# EAGLE design Model55 (EAGLE 6.6.0)
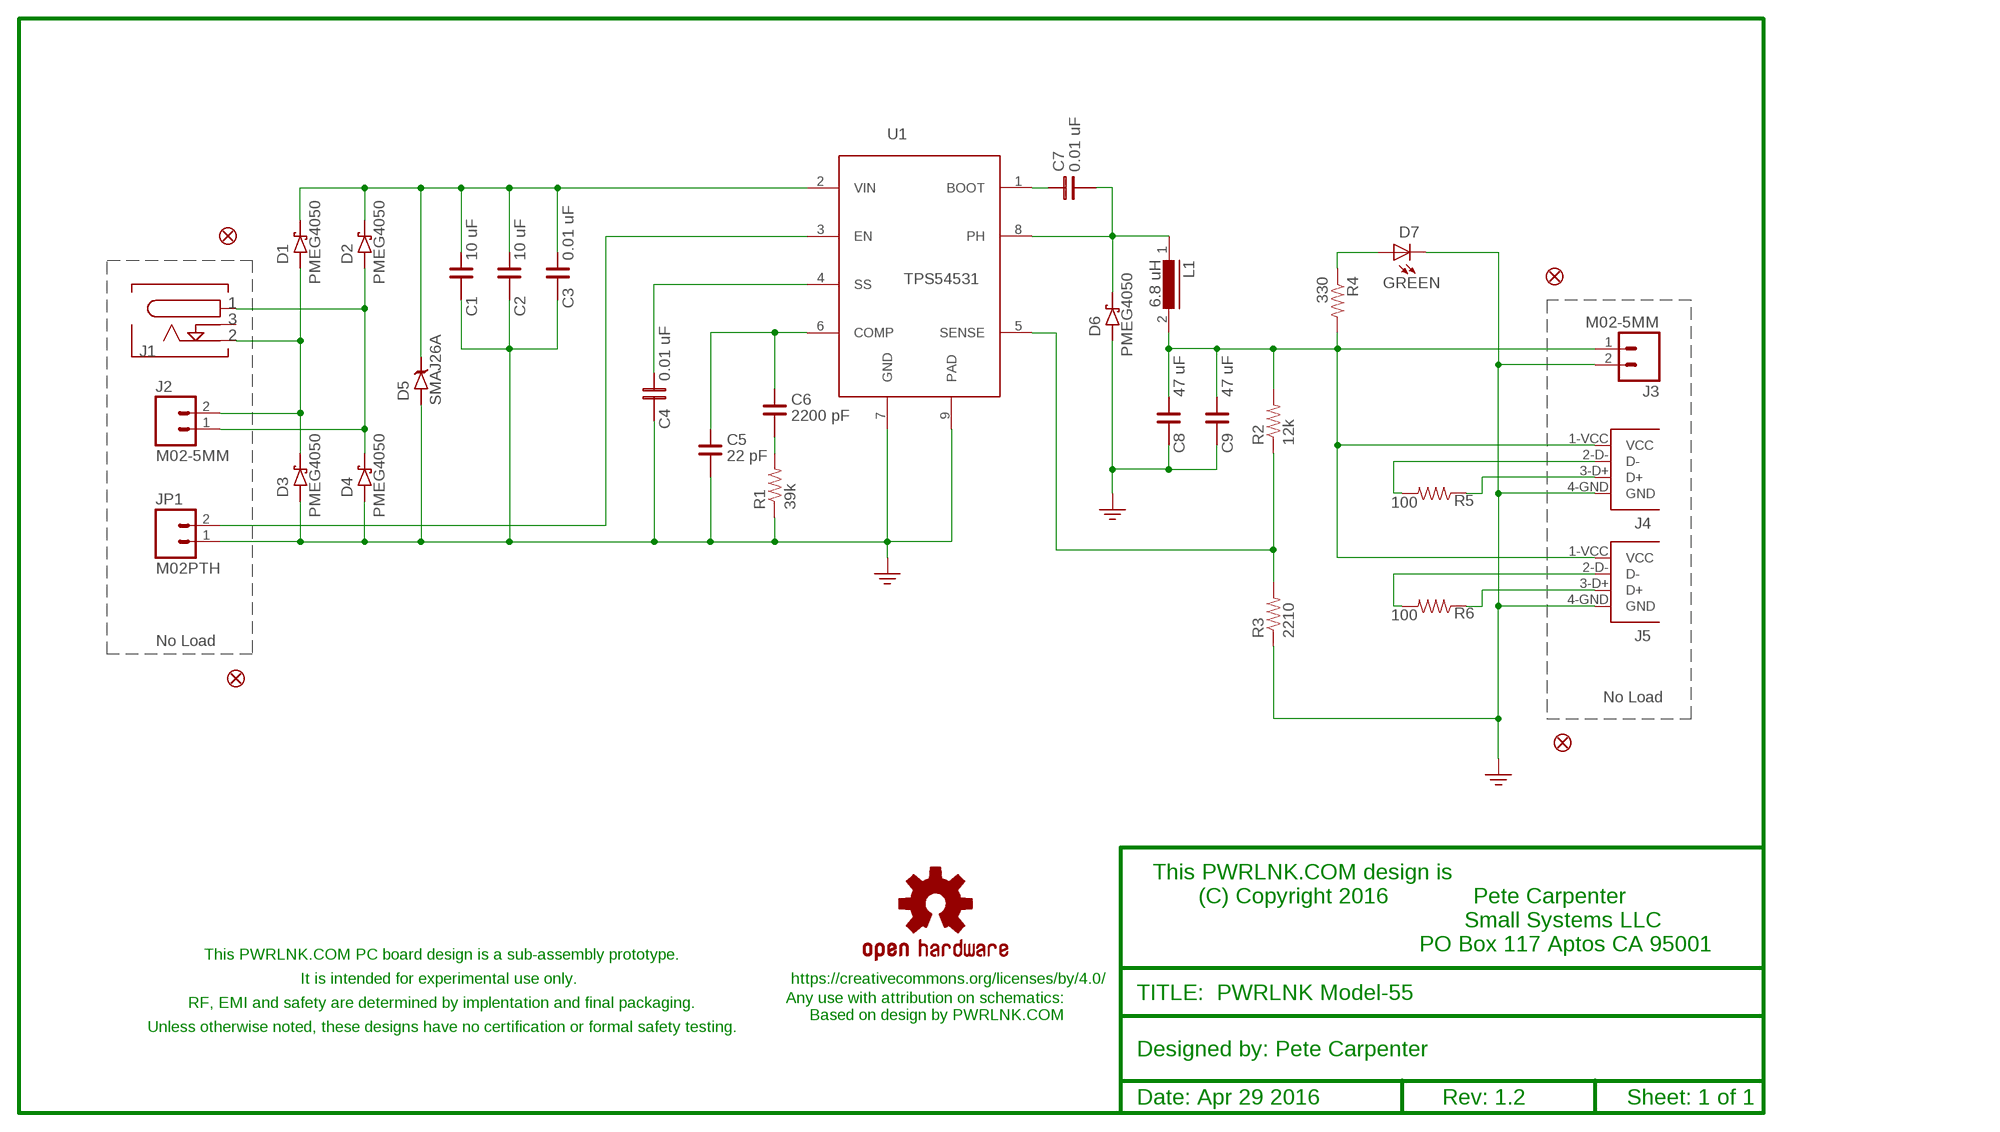
[diagram p0: schematic, sheet 1]

## Parts
C1  10 uF  CN-1210  [1210]
C2  10 uF  CN-1210  [1210]
C3  0.01 uF  CN-0805  [0805]
C4  0.01 uF  CN-0805  [0805]
C5  22 pF  CN-0603  [0603]
C6  2200 pF  CN-0805  [0805]
C7  0.01 uF  CN-0805  [0805]
C8  47 uF  CN-1206  [C1206]
C9  47 uF  CN-1206  [C1206]
D1  PMEG4050EP  [SOD128]
D2  PMEG4050EP  [SOD128]
D3  PMEG4050EP  [SOD128]
D4  PMEG4050EP  [SOD128]
D5  SMAJ26A  [DO214BA]
D6  PMEG4050EP  [SOD128]
D7  GREEN  LED-RED0603  [LED-0603]
FID1  FIDUCIAL1X2  [FIDUCIAL-1X2]
FID2  FIDUCIAL1X2  [FIDUCIAL-1X2]
FID3  FIDUCIAL1X2  [FIDUCIAL-1X2]
FID4  FIDUCIAL1X2  [FIDUCIAL-1X2]
J1  PJ-102AH  [PJ-102AH]
J2  M02-5MM  [SCREWTERMINAL-5MM-2]
J3  M02-5MM  [SCREWTERMINAL-5MM-2]
J4  87520  87520-USB-A-FEMALE  [87520-USB-A-FEMALE]
J5  87520  87520-USB-A-FEMALE  [87520-USB-A-FEMALE]
JP1  M02PTH  [1X02]
L1  6.8 uH  DR125  [DR125]
LOGO1  OSHW-LOGOL  [OSHW-LOGO-L]
R1  39k  47KOHM1/10W1%(0603)  [0603-RES]
R2  12k  47KOHM1/10W1%(0603)  [0603-RES]
R3  2210  47KOHM1/10W1%(0603)  [0603-RES]
R4  330  47KOHM1/10W1%(0603)  [0603-RES]
R5  100  47KOHM1/10W1%(0603)  [0603-RES]
R6  100  47KOHM1/10W1%(0603)  [0603-RES]
U1  TPS54531  [SOIC127P600X170-9N]

## Nets
5V [power]: C8.1 C9.1 J3.1 J4.1-VCC(VCC) J5.1-VCC(VCC) L1.2 R2.2 R4.2
AC1 [power]: D1.P$1A D3.P$2C J1.P$2 J2.2
AC2 [power]: D2.P$1A D4.P$2C J1.P$1 J2.1
BOOT: C7.1 U1.1(BOOT)
COMP: C5.1 C6.1 U1.6(COMP)
D+: J5.3-D+(D+) R6.1
D+1: J4.3-D+(D+) R5.1
D-: J5.2-D-(D-) R6.2
D-1: J4.2-D-(D-) R5.2
ENABLE: JP1.2 U1.3(EN)
GND [power]: C1.2 C2.2 C3.2 C4.2 C5.2 C8.2 C9.2 D3.P$1A D4.P$1A D5.A(P$1A) D6.P$1A D7.C J3.2 J4.4-GND(GND) J5.4-GND(GND) JP1.1 R1.1 R3.1 U1.7(GND) U1.9(PAD)
N$1: C6.2 R1.2
PWRON: D7.A R4.1
SENSE: R2.1 R3.2 U1.5(SENSE)
SLOW: C4.1 U1.4(SS)
VIN [power]: C1.1 C2.1 C3.1 D1.P$2C D2.P$2C D5.C(P$2C) U1.2(VIN)
VSW [power]: C7.2 D6.P$2C L1.1 U1.8(PH)
Unconnected: J1.P$3

## Notes on the sheet
- No Load
- No Load
- This PWRLNK.COM design is 
         (C) Copyright 2016             Pete Carpenter
                                                  Small Systems LLC
                                           PO Box 117 Aptos CA 95001
- This PWRLNK.COM PC board design is a sub-assembly prototype.
- It is intended for experimental use only. | https://creativecommons.org/licenses/by/4.0/
- Any use with attribution on schematics:
     Based on design by PWRLNK.COM
- TITLE:  PWRLNK Model-55
- RF, EMI and safety are determined by implentation and final packaging.
- Unless otherwise noted, these designs have no certification or formal safety testing.
- Designed by: Pete Carpenter
- Date: Apr 29 2016 | Rev: 1.2 | Sheet: 1 of 1

## Library data of the parts
C1 C2 = PeteCarp-passives:CN-1210
C3 C4 C6 C7 = passives:CN-0805
C5 = PeteCarp-passives:CN-0603
C8 C9 = passives:CN-1206
D1-D4 D6 = semi:PMEG4050EP
D5 = semi:SMAJ26A
D7 = SparkFun-LED:LED-RED: Assorted Red LEDs LilyPad 1206- DIO-09912 1206- DIO-00809 0603- DIO-00819; PROD_ID: DIO-00819; VALUE: RED
FID1-FID4 = SparkFun-Aesthetics:FIDUCIAL: Fiducial Alignment Points Various fiducial points for machine vision alignment.
J1 = PeteCarp-mech:PJ-102AH
J2 J3 = PeteCarp-mech:M02-5MM
J4 J5 = PeteCarp-mech:87520-USB-A-FEMALE
JP1 = SparkFun-Connectors:M02: Standard 2-pin 0.1" header. Use with - straight break away headers ( PRT-00116) - right angle break away headers (PRT-00553) - swiss pins (PRT-00743) - machine pins (PRT-00117) - female headers (PRT-00115) Molex polarized connector foot print use with: PRT-08233 with associated crimp pins and housings. 2.54_SCREWTERM for use with PRT-10571. 3.5mm Screw Terminal footprints for PRT-08084 5mm Screw Terminal footprints for use with PRT-08433
L1 = inductors:DR125: High Power Density, High Efficiency, Shielded Inductors Source: coiltronics_dr_series.pdf
LOGO1 = SparkFun-Aesthetics:OSHW-LOGO: Open Source Hardware Logo This logo indicates the piece of hardware it is found on incorporates a OSHW license and/or adheres to the definition of open source hardware found here: http://freedomdefined.org/OSHW
R1-R6 = SparkFun-Resistors:47KOHM1/10W1%(0603): RES-07871; PROD_ID: RES-07871; VALUE: 47K
U1 = semi:TPS54531

## Net classes
1 ground: width 0.813 mm, drill 0.61 mm, clearance 0.305 mm
2 power: width 0.813 mm, drill 0.61 mm, clearance 0.305 mm

## Board
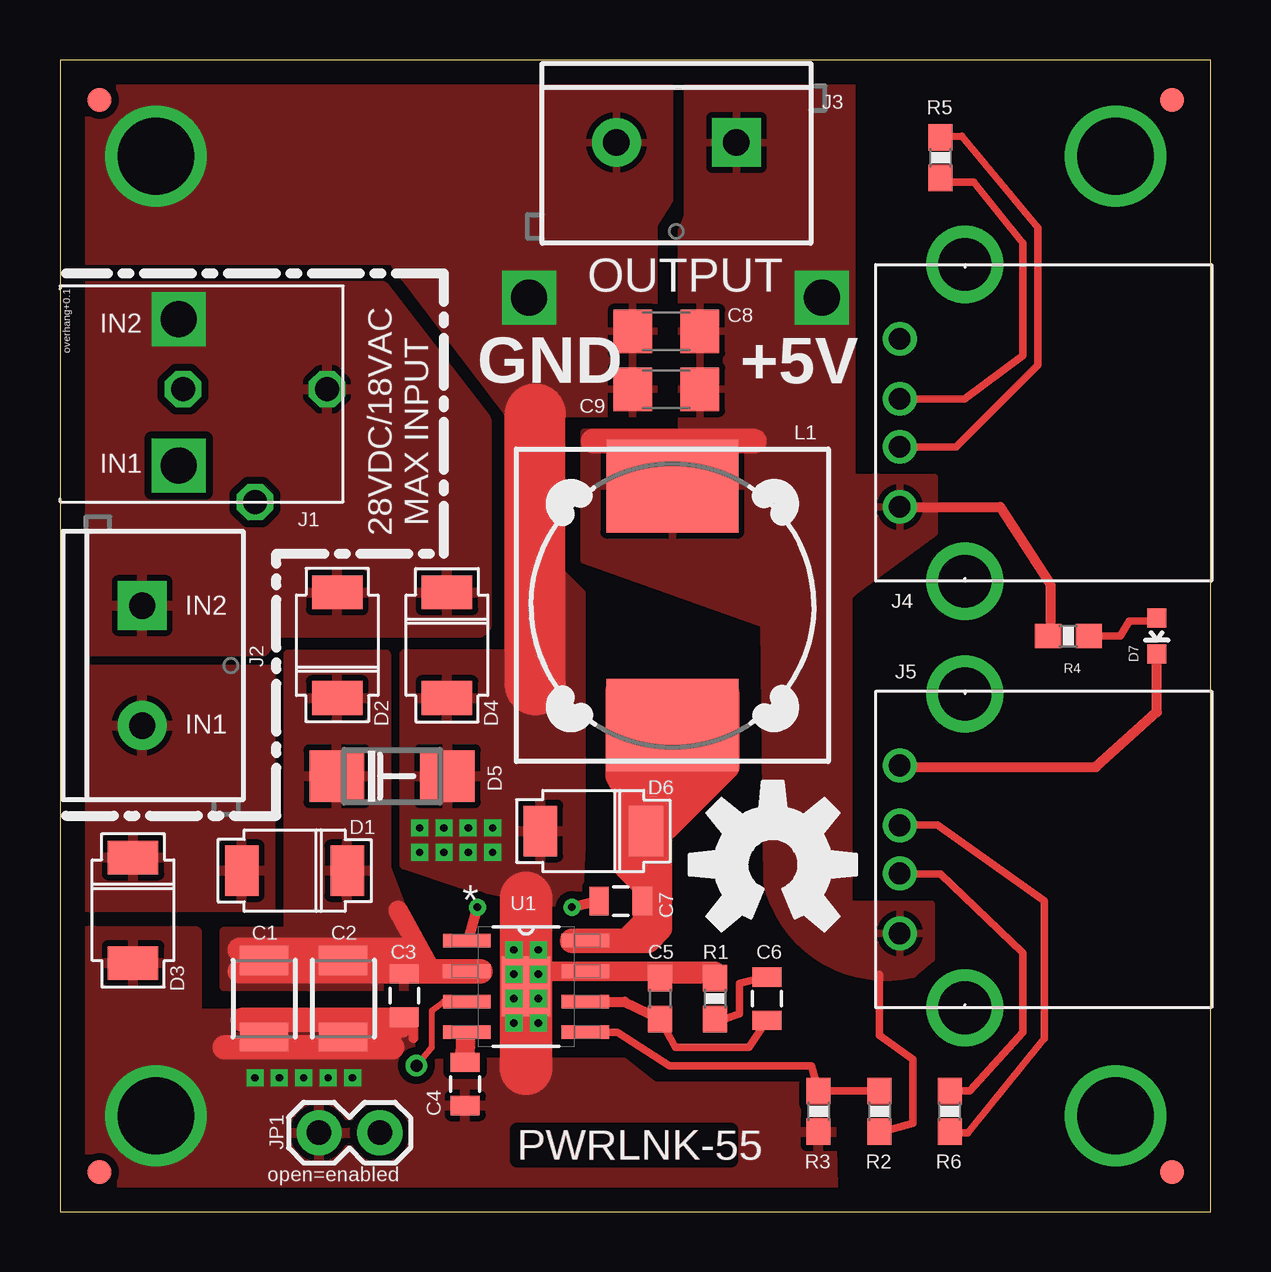
[diagram p1: board, top side]
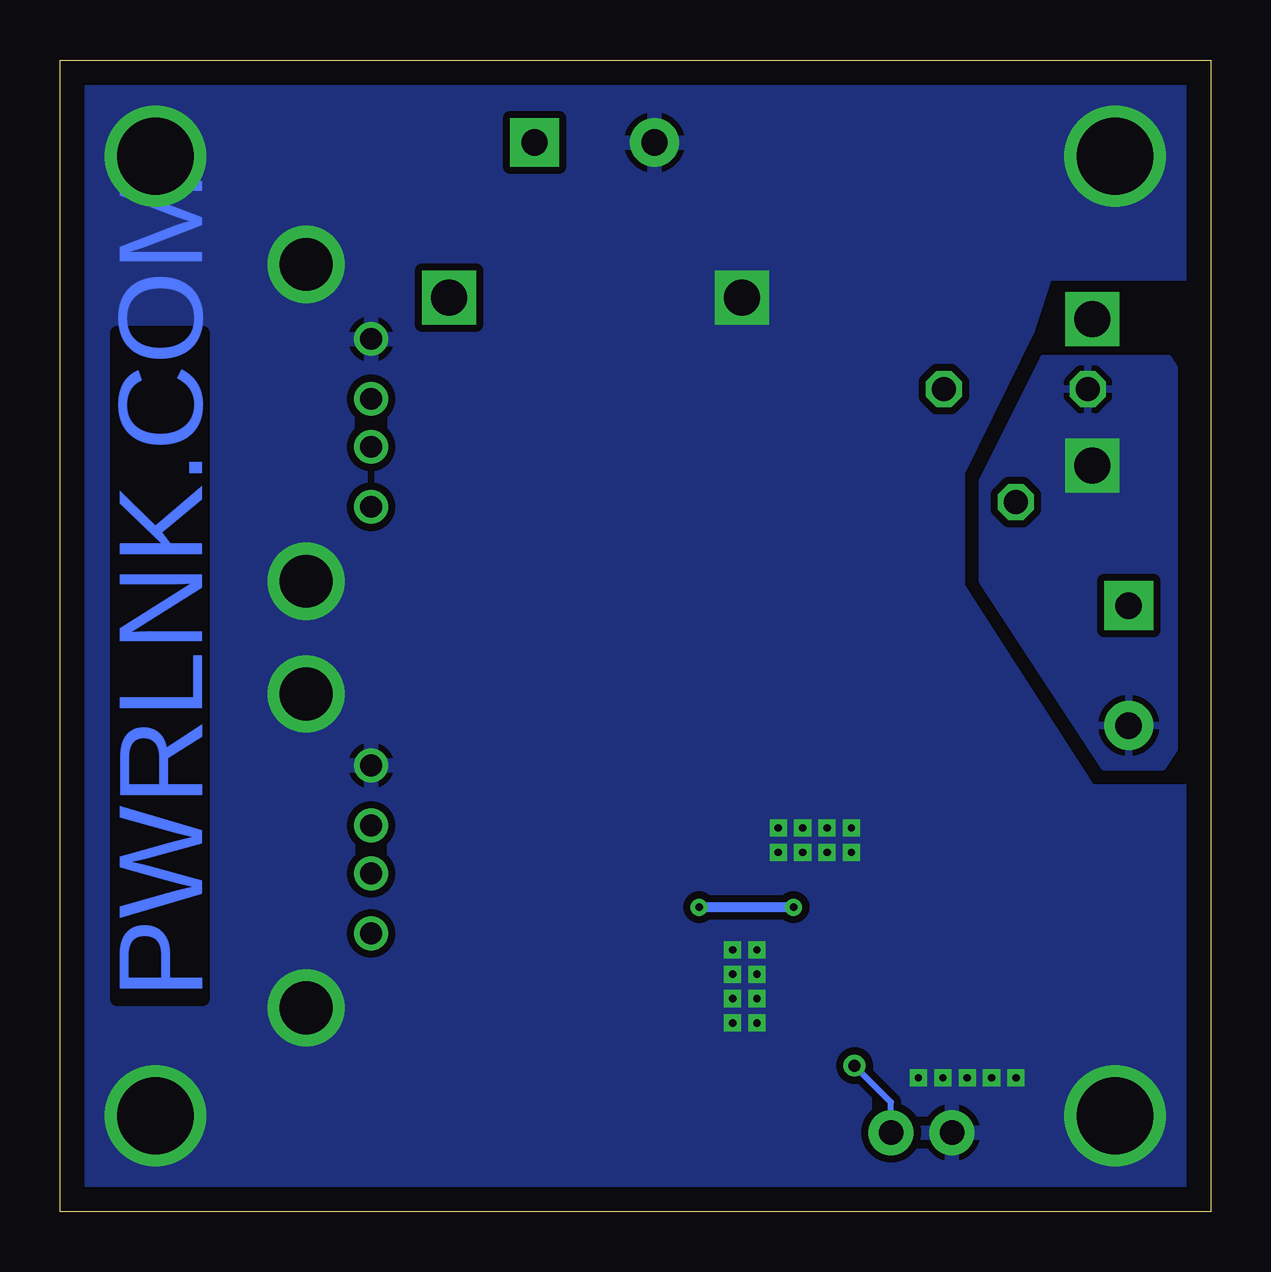
[diagram p2: board, bottom side, seen from below]

Size 47.98 x 48.02 mm. Coordinates in mm from the lower left corner, seen from the top.
Outline: 0,0 47.98,0 47.98,48.02 0,48.02 0,0
Copper layers (1*16): Top 0.035mm / dielectric 1.5mm / Bottom 0.035mm
Design rules "default *": minimum track width 12mil, minimum drill 12mil, track to track 12mil, track to pad 12mil, pad to pad 12mil, via to via 12mil, smd to smd 12mil, copper to edge 40mil, drill to drill 12mil, minimum pad ring 10mil, minimum via ring 8mil, stop-mask expansion 4mil, vias tented up to drill 0mil, thermal gap 10mil
tKeepout: area 1,1 to 7,7; area 1,41 to 7,47; area 41,41 to 47,47; area 41,1 to 47,7

### Footprints (pad centres in the part's own frame; a part is rotated, then mirrored left to right if it is on the bottom)
1210 = smd 1.2 x 2: 1 -1.6,0; 2 1.6,0
0805 = smd 0.8 x 1.2: 1 -0.9,0; 2 0.9,0
0603 = smd 1.1 x 1: 1 -0.85,0; 2 0.85,0
C1206 = smd 1.6 x 1.8: 1 -1.4,0; 2 1.4,0
SOD128 = smd 1.4 x 2.1: P$1A -2.2,0; P$2C 2.2,0
DO214BA = smd 2.286 x 2.159: A 2.304,0; C -2.304,0
LED-0603 = smd 0.8 x 0.8: A 0,-0.75; C 0,0.75
FIDUCIAL-1X2 = smd 1 x 1: 1 0,0
PJ-102AH = drill 1 octagon: P$1 3,0; P$2 -3,0; P$3 0,-4.7
SCREWTERMINAL-5MM-2 = drill 1.1 pad 2.032 square: 1 0,0 | drill 1.1 pad 2.032: 2 5,0
87520-USB-A-FEMALE = drill 0.9: 1-VCC 3.1,13; 2-D- 5.6,13; 3-D+ 7.6,13; 4-GND 10.1,13
1X02 = drill 1.016 pad 1.88: 1 0,0; 2 2.54,0
DR125 = smd 3.85 x 5.5: 1 -4.975,0; 2 4.975,0
0603-RES = smd 1.1 x 1: 1 -0.85,0; 2 0.85,0
SOIC127P600X170-9N = smd 1.981 x 0.559: 1 -2.464,1.905; 2 -2.464,0.635; 3 -2.464,-0.635; 4 -2.464,-1.905; 5 2.464,-1.905; 6 2.464,-0.635; 7 2.464,0.635; 8 2.464,1.905 | smd 2.007 x 2.489: 9 0,0

### Placement (x,y rotation side)
C1  8.51,8.89 270 top
C2  11.81,8.89 270 top
C3  14.35,9.02 270 top
C4  16.89,5.33 270 top
C5  25.02,8.89 90 top
C6  29.46,8.89 90 top
C7  23.37,12.95 0 top
C8  25.27,36.7 180 top
C9  25.27,34.29 180 top
D1  9.78,14.22 0 top
D2  11.56,23.62 270 top
D3  3.05,12.57 90 top
D4  16.13,23.62 90 top
D5  13.84,18.16 0 top
D6  22.23,15.88 0 top
D7  45.72,24 180 top
FID1  1.65,46.35 0 top
FID2  46.35,46.35 0 top
FID3  46.35,1.65 0 top
FID4  1.65,1.65 0 top
J1  8.13,34.29 0 top
J2  3.43,25.27 270 top
J3  28.19,44.58 180 top
J4  48.01,26.29 90 top
J5  48.01,8.51 90 top
JP1  10.79,3.3 0 top
L1  25.53,25.27 90 top
LOGO1  29.72,14.48 0 top
R1  27.3,8.89 270 top
R2  34.16,4.19 270 top
R3  31.62,4.19 90 top
R4  42.04,24 180 top
R5  36.7,43.94 90 top
R6  37.08,4.19 90 top
U1  19.43,9.4 0 top

### Tracks (layer width: path | path; a pad name or v marks a point on that pad's centre or on a via)
5V  (via drill 1.5 pad 2.18)
  Top 0.305: 34.67,11.44 J5.1-VCC | 34.16,9.91 34.16,7.37 35.56,6.35 35.56,3.68 34.12,3.3 R2.2
  Top 0.406: J4.1-VCC 39.19,29.39 41.27,26.16 41.27,24.34 R4.2
  Top 1.016: 22.23,32.13 28.96,32.13
  other vias: 31.75,38.1
  pour Top: 33.02,47.82 26.16,47.82 26.16,41.53 25.91,40.89 25.91,32.51 21.84,32.51 21.84,27.18 29.34,24.51 29.46,13.72 arc90 35.56,9.91 36.32,10.54 36.32,12.83 32.89,12.83 32.89,25.65 33.15,25.91 36.45,28.32 36.45,30.61 33.02,30.61
AC1  (via drill 1.5 pad 2.18)
  other vias: 4.95,31.11
  pour Top: 0.25,22.61 8.76,22.61 8.76,12.7 0.25,12.7
  pour Bottom: 1.52,35.18 1.78,35.56 6.99,35.56 9.53,30.48 9.53,26.29 4.45,18.54 2.03,18.54 1.52,19.3
AC2  (via drill 1.5 pad 2.18)
  other vias: 4.95,37.21
  pour Top: 0.25,38.61 13.46,38.61 17.78,33.02 17.78,24.38 17.53,24.13 9.02,24.13 8.51,23.37 0.25,23.37
BOOT  (via drill 0.3)
  Top 0.406: U1.1 17.02,11.3 | 17.14,11.3 17.02,11.3 | 17.02,11.3 v17.4,12.7 | C7.1 v21.34,12.7
  Bottom 0.406: v17.4,12.7 v21.34,12.7
COMP
  Top 0.305: 25.02,8 25.65,6.86 28.71,6.86 C6.1
  Top 0.406: U1.6 23.53,8.76 C5.1 25.02,8
D+
  Top 0.305: J5.3-D+ 35.53,16.13 36.58,16.13 41.02,12.95 41.02,7.24 37.85,3.3 37.25,3.3 R6.1
D+1
  Top 0.305: J4.3-D+ 37.7,33.89 40.13,35.69 40.13,40.39 38.1,42.93 37,42.93 R5.1
D-
  Top 0.305: J5.2-D- 35.15,14.1 36.7,14.1 40.13,10.79 40.13,7.49 37.93,5.04 R6.2
D-1
  Top 0.305: J4.2-D- 37.35,31.89 40.77,35.31 40.77,41.02 37.59,44.83 R5.2
ENABLE  (via drill 0.5)
  Top 0.254: 16,8.76 15.49,8.38 15.49,6.86 v14.86,6.1
  Top 0.305: U1.3 16,8.76
  Bottom 0.254: JP1.2 13.34,4.57 v14.86,6.1
GND  (via drill 0.3, 1.5 pad 2.18, 2.2, 3.2 pad 3.2)
  Top 0.305: 19.81,10.03 v19.94,9.91 | 27.05,9.79 27.3,10.03 R1.1
  Top 0.406: J5.4-GND 35.07,18.54 43.18,18.54 45.72,20.83 D7.C | 14.35,8 14.35,7.62 | 14.35,7.62 13.72,6.99 12.14,6.99 | 12.7,7.49 14.35,7.49 14.35,7.62 | 14.73,7.24 14.73,7.62 14.35,7.62 | C5.2 R1.1
  Top 0.813: 19.81,10.03 U1.7 27.3,10.03
  Top 1.016: 6.86,6.86 13.84,6.86 | 7.62,8 14.35,8
  Top 2.184: 19.43,13.08 U1.9 19.43,5.97
  Top 2.54: 19.81,21.97 19.81,33.27
  other vias: 18.92,9.91 19.94,8.89 18.92,8.89 19.94,10.92 18.92,10.92 19.94,7.87 18.92,7.87 37.72,21.59 37.72,26.29 37.72,39.5 17.02,14.99 17.02,16 16,16 14.99,16 37.72,8.51 16,14.99 14.99,14.99 19.56,38.1 18.03,16 18.03,14.99 9.14,5.59 8.13,5.59 10.16,5.59 11.18,5.59 12.19,5.59 4,4 4,44 44,44 44,4
  pour Bottom: 0.31,47.72 47.72,47.72 47.62,0.31 0.28,0.28 0.25,17.53 5.08,17.53 10.54,26.04 10.54,30.86 7.62,36.83 6.86,39.12 0.38,39.12
  pour Top: 32.26,0.18 32.13,5.21 24.77,5.21 23.5,6.22 16.13,6.22 14.61,6.99 14.61,8.26 5.71,8.26 5.71,11.68 0.38,11.68 0.18,0.18
  pour Top: 14.35,23.24 14.35,14.48 16.64,13.72 21.59,12.7 21.72,15.24 21.72,25.78 20.7,26.8 20.83,24.38 20.07,24.38 18.92,23.24
  pour Top: 0.15,47.82 25.4,47.82 25.4,42.16 24.77,41.15 24.77,33.27 18.67,33.27 13.84,39.62 0.13,39.62
N$1
  Top 0.305: C6.2 28.82,9.65 28.32,9.53 28.32,8.26 27.73,8.04 R1.2
PWRON
  Top 0.305: R4.1 44.2,24 44.58,24.64 45.45,24.64 D7.A
SENSE
  Top 0.305: U1.5 23.24,7.49 25.4,6.1 31.33,6.1 R3.2 R2.1
SLOW
  Top 0.406: 17.09,7.49 U1.4 16.9,7.37
  Top 0.813: 16.9,7.37 C4.1
VIN
  Top 0.813: 15.49,10.03 14.1,12.57 | 14.73,10.03 14.73,10.92
  Top 1.016: 17.53,10.03 U1.2 15.49,10.03 14.73,10.03 7.49,10.03 | 14.86,10.92 14.73,10.92 7.49,10.92
  pour Top: 9.53,23.24 13.59,23.24 13.59,14.35 14.48,12.06 15.24,9.65 14.99,9.4 6.86,9.4 6.86,11.68 9.53,11.68
VSW
  Top 0.305: 25.02,11.81 25.02,11.94
  Top 0.61: 24,18.29 25.27,21.72 L1.1 | D6.P$2C 23.62,15.62 23.62,14.86 | C7.2 24.19,12.7 24.19,11.87
  Top 1.016: 21.34,11.3 U1.8 23.62,11.3 | 23.62,11.3 24.51,11.3 25.02,11.81 | 23.62,11.3 24.19,11.87 24.38,12.06 24.38,13.59 23.62,14.35 23.62,14.86 23.62,17.53 23.24,18.16 23.24,21.72 24,18.29 27.69,21.72 27.81,21.59 27.81,18.54 25.27,16 | 25.02,11.94 25.02,17.02 27.05,18.8 25.4,18.41 24.13,17.14 | 24.13,17.14 24.13,18.03 | 24.13,17.14 24.13,14.35 24.38,14.1

### Text on the board
Top: PWRLNK-55
Bottom: PWRLNK.COM
tPlace: OUTPUT | IN2 | +5V | GND | IN1 | 28VDC/18VAC / MAX INPUT | IN2 | IN1 | PWRLNK-55 | open=enabled